# EAGLE design henryfc_v1.1 (EAGLE 9.6.2)
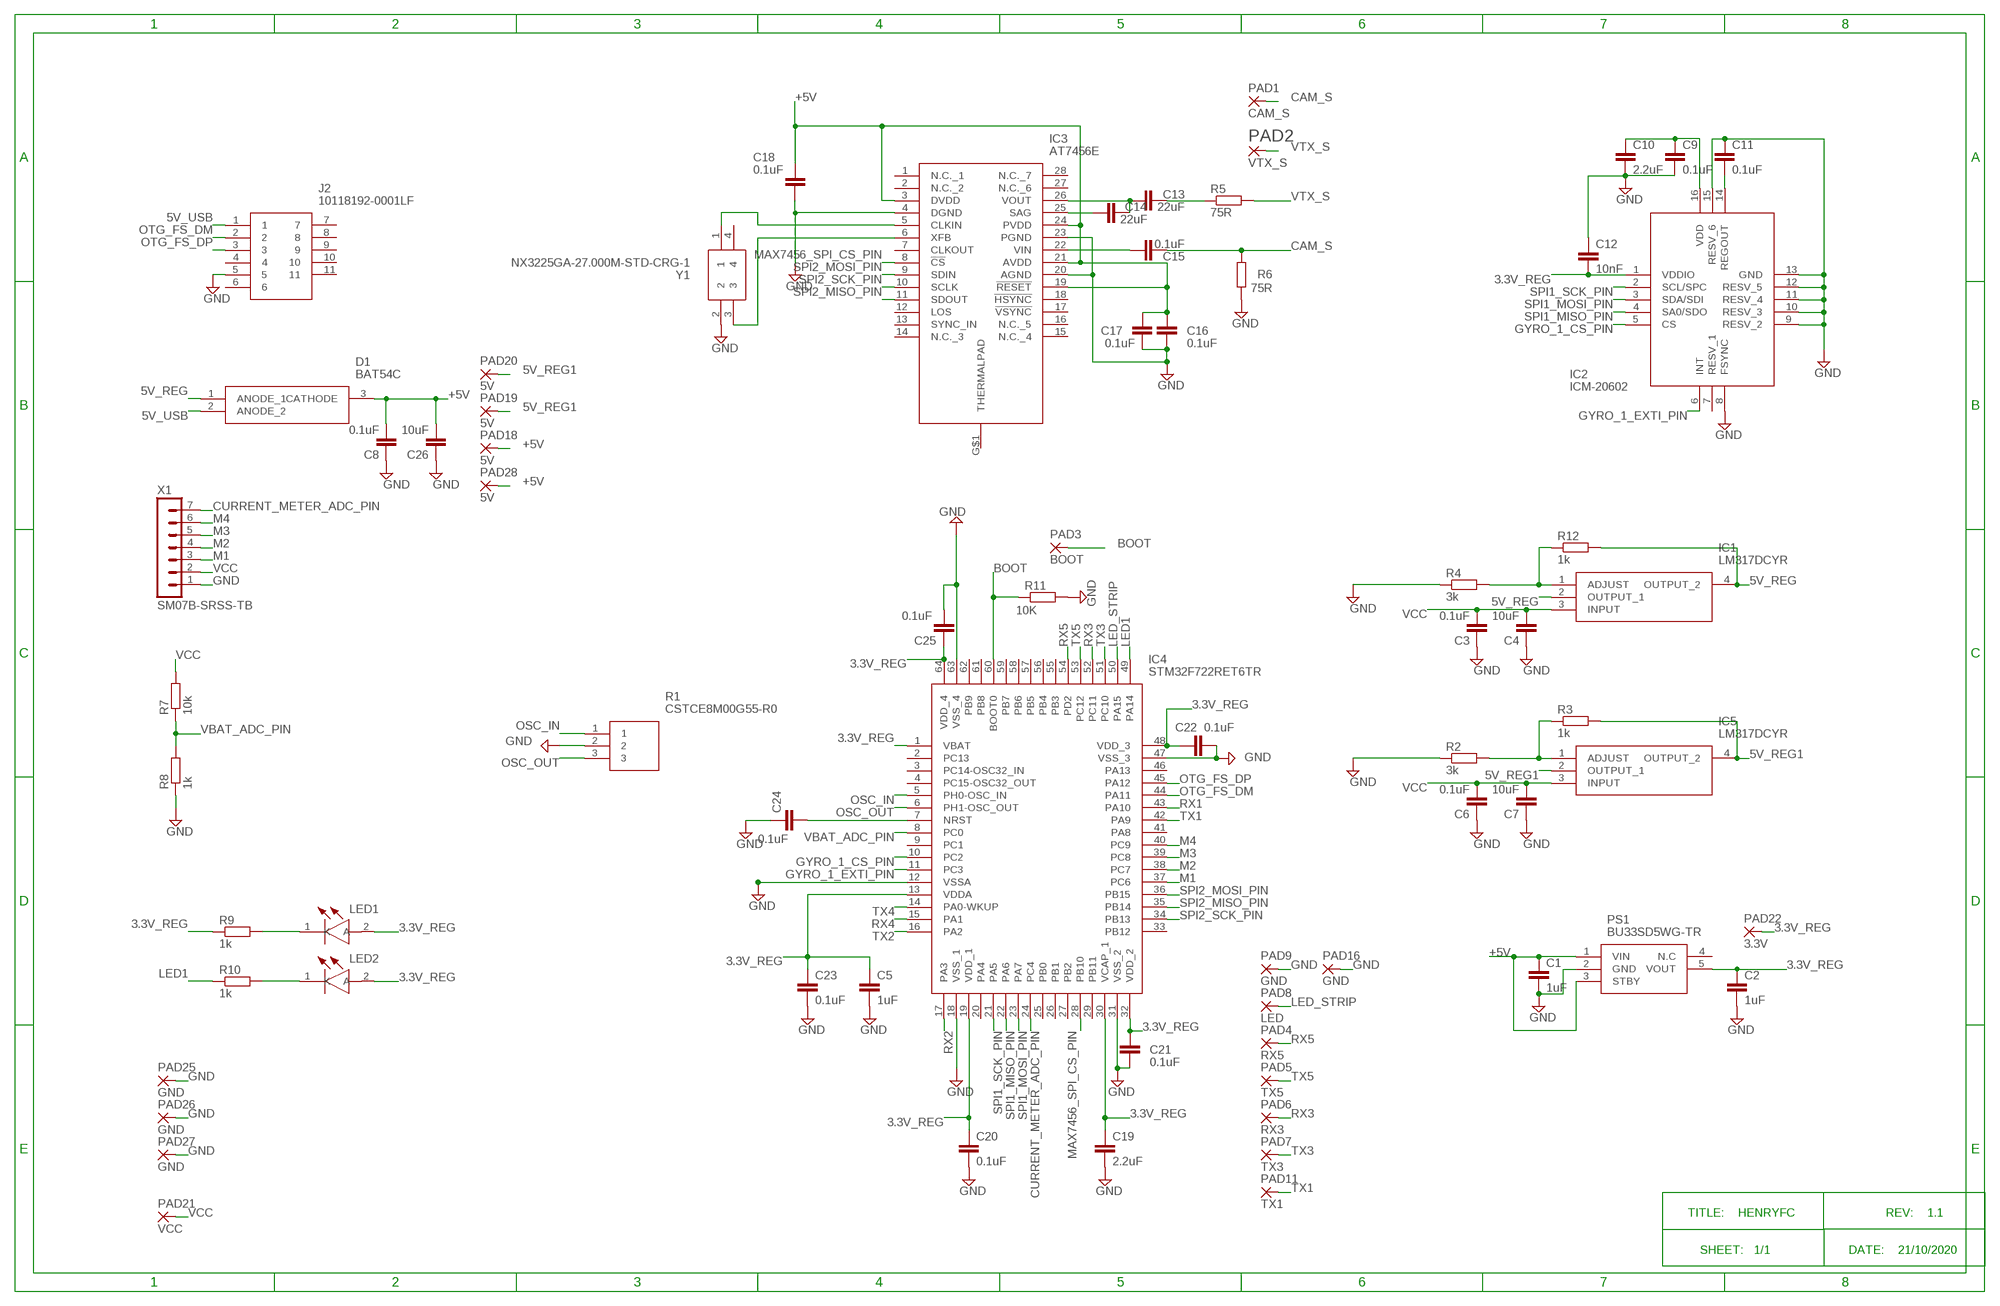
[diagram p0: schematic, sheet 1]

## Parts
C1  1uF  C-EUC0603  [C0603]
C2  1uF  C-EUC0603  [C0603]
C3  0.1uF  C-EUC0805  [C0805]
C4  10uF  C-EUC0805  [C0805]
C5  1uF  C-EUC0603  [C0603]
C6  0.1uF  C-EUC0805  [C0805]
C7  10uF  C-EUC0805  [C0805]
C8  0.1uF  C-EUC0805  [C0805]
C9  0.1uF  C-EUC0603  [C0603]
C10  2.2uF  C-EUC0603  [C0603]
C11  0.1uF  C-EUC0603  [C0603]
C12  10nF  C-EUC0603  [C0603]
C13  22uF  C-EUC0603  [C0603]
C14  22uF  C-EUC0603  [C0603]
C15  0.1uF  C-EUC0603  [C0603]
C16  0.1uF  C-EUC0603  [C0603]
C17  0.1uF  C-EUC0603  [C0603]
C18  0.1uF  C-EUC0603  [C0603]
C19  2.2uF  C-EUC0603  [C0603]
C20  0.1uF  C-EUC0603  [C0603]
C21  0.1uF  C-EUC0603  [C0603]
C22  0.1uF  C-EUC0603  [C0603]
C23  0.1uF  C-EUC0603  [C0603]
C24  0.1uF  C-EUC0603  [C0603]
C25  0.1uF  C-EUC0603  [C0603]
C26  10uF  C-EUC0805  [C0805]
D1  BAT54C  [SOT95P240X120-3N]
IC1  LM317DCYR  [SOT230P700X180-4N]
IC2  ICM-20602  [PULL-BACK-QFN-16]
IC3  AT7456E  [SOP65P640X120-29N]
IC4  STM32F722RET6TR  [QFP50P1200X1200X160-64N]
IC5  LM317DCYR  [SOT230P700X180-4N]
J2  10118192-0001LF  [101181920001LF]
LED1  KB_DELPS2.12-QHRI-24-Z555-10-S  [KBDELPS212QHRI24Z55510S]
LED2  KR_DELPS1.22-UHVI-26-H3Q4  [KRDELPS122UHVI26H3Q4]
PAD1  CAM_S  SMD2  [SMD1,27-2,54]
PAD2  VTX_S  SMD2  [SMD1,27-2,54]
PAD3  BOOT  SMD2  [SMD1,27-2,54]
PAD4  RX5  SMD2  [SMD1,27-2,54]
PAD5  TX5  SMD2  [SMD1,27-2,54]
PAD6  RX3  SMD2  [SMD1,27-2,54]
PAD7  TX3  SMD2  [SMD1,27-2,54]
PAD8  LED  SMD2  [SMD1,27-2,54]
PAD9  GND  SMD2  [SMD1,27-2,54]
PAD11  TX1  SMD2  [SMD1,27-2,54]
PAD16  GND  SMD2  [SMD1,27-2,54]
PAD18  5V  SMD2  [SMD1,27-2,54]
PAD19  5V  SMD2  [SMD1,27-2,54]
PAD20  5V  SMD2  [SMD1,27-2,54]
PAD21  VCC  SMD2  [SMD1,27-2,54]
PAD22  3.3V  SMD2  [SMD1,27-2,54]
PAD25  GND  SMD2  [SMD1,27-2,54]
PAD26  GND  SMD2  [SMD1,27-2,54]
PAD27  GND  SMD2  [SMD1,27-2,54]
PAD28  5V  SMD2  [SMD1,27-2,54]
PS1  BU33SD5WG-TR  [SOT95P280X125-5N]
R1  CSTCE8M00G55-R0  [CSTCE12M0G55-R0]
R2  3k  R-EU_R0603  [R0603]
R3  1k  R-EU_R0603  [R0603]
R4  3k  R-EU_R0603  [R0603]
R5  75R  R-EU_R0603  [R0603]
R6  75R  R-EU_R0603  [R0603]
R7  10k  R-EU_R0603  [R0603]
R8  1k  R-EU_R0603  [R0603]
R9  1k  R-EU_R0603  [R0603]
R10  1k  R-EU_R0603  [R0603]
R11  10K  R-EU_R0603  [R0603]
R12  1k  R-EU_R0603  [R0603]
X1  SM07B-SRSS-TB  [SM07B-SRSS-TB]
Y1  NX3225GA-27.000M-STD-CRG-1  [NX3225GA]

## Nets
3.3V_REG: C2.1 C5.1 C12.2 C19.1 C20.1 C21.1 C22.1 C23.1 C25.1 IC2.1(VDDIO) IC4.1(VBAT) IC4.13(VDDA) IC4.19(VDD_1) IC4.30(VCAP_1) IC4.32(VDD_2) IC4.48(VDD_3) IC4.64(VDD_4) LED1.2(A) LED2.2(A) PAD22.1(P) PS1.5(VOUT) R9.1
5V_REG: D1.1(ANODE_1) IC1.2(OUTPUT_1) IC1.4(OUTPUT_2) R12.2
5V_REG1: IC5.2(OUTPUT_1) IC5.4(OUTPUT_2) PAD19.1(P) PAD20.1(P) R3.2
5V_USB: D1.2(ANODE_2) J2.1
+5V: C1.1 C8.2 C16.1 C17.1 C18.2 C26.2 D1.3(CATHODE) IC3.3(DVDD) IC3.19(!RESET) IC3.21(AVDD) IC3.24(PVDD) PAD18.1(P) PAD28.1(P) PS1.1(VIN) PS1.3(STBY)
BOOT: IC4.60(BOOT0) PAD3.1(P) R11.1
CAM_S: C15.2 PAD1.1(P) R6.2
CURRENT_METER_ADC_PIN: IC4.24(PC4) X1.7
GND: C1.2 C2.2 C3.1 C4.1 C5.2 C6.1 C7.1 C8.1 C9.2 C10.2 C11.1 C12.1 C16.2 C17.2 C18.1 C19.2 C20.2 C21.2 C22.2 C23.2 C24.1 C25.2 C26.1 IC2.8(FSYNC) IC2.9(RESV_2) IC2.10(RESV_3) IC2.11(RESV_4) IC2.12(RESV_5) IC2.13(GND) IC2.15(RESV_6) IC3.4(DGND) IC3.20(AGND) IC3.23(PGND) IC4.12(VSSA) IC4.18(VSS_1) IC4.31(VSS_2) IC4.47(VSS_3) IC4.63(VSS_4) J2.5 PAD9.1(P) PAD16.1(P) PAD25.1(P) PAD26.1(P) PAD27.1(P) PS1.2(GND) R1.2 R2.1 R4.1 R6.1 R8.1 R11.2 X1.1 Y1.2
GYRO_1_CS_PIN: IC2.5(CS) IC4.10(PC2)
GYRO_1_EXTI_PIN: IC2.6(INT) IC4.11(PC3)
LED1: IC4.49(PA14) R10.1
LED_STRIP: IC4.50(PA15) PAD8.1(P)
M1: IC4.37(PC6) X1.3
M2: IC4.38(PC7) X1.4
M3: IC4.39(PC8) X1.5
M4: IC4.40(PC9) X1.6
MAX7456_SPI_CS_PIN: IC3.8(!CS) IC4.28(PB10)
N$1: IC5.1(ADJUST) R2.2 R3.1
N$2: IC1.1(ADJUST) R4.2 R12.1
N$5: C9.1 C10.1 IC2.16(VDD)
N$7: C11.2 IC2.14(REGOUT)
N$8: C14.1 IC3.25(SAG)
N$9: C13.1 C14.2 IC3.26(VOUT)
N$10: C13.2 R5.1
N$11: IC3.6(XFB) Y1.3
N$12: C15.1 IC3.22(VIN)
N$13: IC3.5(CLKIN) Y1.1
N$14: LED1.1(K) R9.2
N$15: LED2.1(K) R10.2
NRST: C24.2 IC4.7(NRST)
OSC_IN: IC4.5(PH0-OSC_IN) R1.1
OSC_OUT: IC4.6(PH1-OSC_OUT) R1.3
OTG_FS_DM: IC4.44(PA11) J2.2
OTG_FS_DP: IC4.45(PA12) J2.3
RX1: IC4.43(PA10)
RX2: IC4.17(PA3)
RX3: IC4.52(PC11) PAD6.1(P)
RX4: IC4.15(PA1)
RX5: IC4.54(PD2) PAD4.1(P)
SPI1_MISO_PIN: IC2.4(SA0/SDO) IC4.22(PA6)
SPI1_MOSI_PIN: IC2.3(SDA/SDI) IC4.23(PA7)
SPI1_SCK_PIN: IC2.2(SCL/SPC) IC4.21(PA5)
SPI2_MISO_PIN: IC3.11(SDOUT) IC4.35(PB14)
SPI2_MOSI_PIN: IC3.9(SDIN) IC4.36(PB15)
SPI2_SCK_PIN: IC3.10(SCLK) IC4.34(PB13)
TX1: IC4.42(PA9) PAD11.1(P)
TX2: IC4.16(PA2)
TX3: IC4.51(PC10) PAD7.1(P)
TX4: IC4.14(PA0-WKUP)
TX5: IC4.53(PC12) PAD5.1(P)
VBAT_ADC_PIN: IC4.8(PC0) R7.1 R8.2
VCC: C3.2 C4.2 C6.2 C7.2 IC1.3(INPUT) IC5.3(INPUT) PAD21.1(P) R7.2 X1.2
VTX_S: PAD2.1(P) R5.2
Unconnected: IC2.7(RESV_1) IC3.1(N.C._1) IC3.2(N.C._2) IC3.7(CLKOUT) IC3.12(LOS) IC3.13(SYNC_IN) IC3.14(N.C._3) IC3.15(N.C._4) IC3.16(N.C._5) IC3.17(!VSYNC) IC3.18(!HSYNC) IC3.27(N.C._6) IC3.28(N.C._7) IC3.G$1(THERMALPAD) IC4.2(PC13) IC4.3(PC14-OSC32_IN) IC4.4(PC15-OSC32_OUT) IC4.9(PC1) IC4.20(PA4) IC4.25(PB0) IC4.26(PB1) IC4.27(PB2) IC4.29(PB11) IC4.33(PB12) IC4.41(PA8) IC4.46(PA13) IC4.55(PB3) IC4.56(PB4) IC4.57(PB5) IC4.58(PB6) IC4.59(PB7) IC4.61(PB8) IC4.62(PB9) J2.4 J2.6 J2.7 J2.8 J2.9 J2.10 J2.11 PS1.4(N.C) Y1.4

## Notes on the sheet
- TITLE:    HENRYFC | REV:    1.1
- SHEET:   1/1 | DATE:    21/10/2020

## Library data of the parts
C1-C26 = rcl:C-EU: CAPACITOR, European symbol; SPICEPREFIX: C
D1 = SamacSys_Parts:BAT54C: 30 V Dual Common Cathode Schottky Diode Source: Datasheet <http://www.onsemi.com/pub/Collateral/BAT54-D.PDF>; ARROW_PART_NUMBER: BAT54C; ARROW_PRICE-STOCK: https://www.arrow.com/en/products/bat54c/on-semiconductor; DESCRIPTION: 30 V Dual Common Cathode Schottky Diode; HEIGHT: 1.2mm; MANUFACTURER_NAME: ON Semiconductor; MANUFACTURER_PART_NUMBER: BAT54C; MOUSER_PART_NUMBER: 512-BAT54C; MOUSER_PRICE-STOCK: https://www.mouser.co.uk/ProductDetail/ON-Semiconductor-Fairchild/BAT54C?qs=WjC1ij5gCHPafNqzK0iwGA%3D%3D
IC1 IC5 = SamacSys_Parts:LM317DCYR: LM317DCYR, Linear Voltage Regulator, 1.5A Adjustable 1.25 37 V, 4-Pin SOT-223 Source: Datasheet <http://www.ti.com/lit/ds/symlink/lm317.pdf>; ARROW_PART_NUMBER: LM317DCYR; ARROW_PRICE-STOCK: https://www.arrow.com/en/products/lm317dcyr/texas-instruments; DESCRIPTION: LM317DCYR, Linear Voltage Regulator, 1.5A Adjustable 1.25 37 V, 4-Pin SOT-223; HEIGHT: 1.8mm; MANUFACTURER_NAME: Texas Instruments; MANUFACTURER_PART_NUMBER: LM317DCYR; MOUSER_PART_NUMBER: 595-LM317DCYR; MOUSER_PRICE-STOCK: https://www.mouser.co.uk/ProductDetail/Texas-Instruments/LM317DCYR?qs=YhsVCygOPE0H9jB5Yaa05Q%3D%3D
IC2 = SamacSys_Parts:ICM-20602: High Performance 6-Axis MEMS MotionTracking Device, QFN-16 Source: Datasheet <https://www.invensense.com/wp-content/uploads/2015/12/ICM-20602-Product-Brief-v1.0.pdf>; ARROW_PART_NUMBER: ICM-20602; ARROW_PRICE-STOCK: https://www.arrow.com/en/products/icm-20602/invensense; DESCRIPTION: High Performance 6-Axis MEMS MotionTracking Device, QFN-16; HEIGHT: mm; MANUFACTURER_NAME: InvenSense Inc.; MANUFACTURER_PART_NUMBER: ICM-20602; MOUSER_PART_NUMBER: 410-ICM-20602; MOUSER_PRICE-STOCK: https://www.mouser.co.uk/ProductDetail/TDK-InvenSense/ICM-20602?qs=u4fy%2FsgLU9NtDChFbqTxBA%3D%3D
IC3 = SamacSys_Parts:AT7456E: Video Character Overlay Chip (OSD) Source: Datasheet <https://datasheet.lcsc.com/szlcsc/ZHONGKEWEI-AT7456E_C82351.pdf>; ARROW_PART_NUMBER: AT7456E; DESCRIPTION: Video Character Overlay Chip (OSD); HEIGHT: 1.2mm; MANUFACTURER_NAME: ICOF; MANUFACTURER_PART_NUMBER: AT7456E
IC4 = SamacSys_Parts:STM32F722RET6TR: ARM Microcontrollers - MCU Source: Datasheet <https://componentsearchengine.com/Datasheets/1/STM32F722RET6TR.pdf>; ARROW_PART_NUMBER: STM32F722RET6TR; DESCRIPTION: ARM Microcontrollers - MCU; HEIGHT: 1.6mm; MANUFACTURER_NAME: STMicroelectronics; MANUFACTURER_PART_NUMBER: STM32F722RET6TR; MOUSER_PART_NUMBER: 511-STM32F722RET6TR; MOUSER_PRICE-STOCK: https://www.mouser.co.uk/ProductDetail/STMicroelectronics/STM32F722RET6TR?qs=%252B6g0mu59x7LDsd7i9LBalQ%3D%3D
J2 = SamacSys_Parts:10118192-0001LF: USB Connectors 5P MICRO USB TYPE B RECEPTACLE Source: Datasheet <https://www.mouser.tw/datasheet/2/18/10118192-1361887.pdf>; ARROW_PART_NUMBER: 10118192-0001LF; ARROW_PRICE-STOCK: https://www.arrow.com/en/products/10118192-0001lf/amphenol-fci; DESCRIPTION: USB Connectors 5P MICRO USB TYPE B RECEPTACLE; HEIGHT: 2.8mm; MANUFACTURER_NAME: Amphenol; MANUFACTURER_PART_NUMBER: 10118192-0001LF; MOUSER_PART_NUMBER: 649-10118192-0001LF; MOUSER_PRICE-STOCK: https://www.mouser.co.uk/ProductDetail/Amphenol-FCI/10118192-0001LF?qs=Ywefl8B65e5bHFoQtIudZg%3D%3D
LED1 = SamacSys_Parts:KB_DELPS2.12-QHRI-24-Z555-10-S: Standard LEDs - SMD Blue TOPLED E 1608 Source: Datasheet <https://www.mouser.in/ProductDetail/OSRAM-Opto-Semiconductors/KB-DELPS212-QHRI-24-Z555-10-S?qs=/ha2pyFaduguGXnxUQPQvOwqvA0l1GbBGsJPdL2BNxwU00XGTd8yf8CXZb0fb41Mz9FjufZkGgQ=>; ARROW_PART_NUMBER: KB DELPS2.12-QHRI-24-Z555-10-S; DESCRIPTION: Standard LEDs - SMD Blue TOPLED E 1608; HEIGHT: mm; MANUFACTURER_NAME: OSRAM; MANUFACTURER_PART_NUMBER: KB DELPS2.12-QHRI-24-Z555-10-S; MOUSER_PART_NUMBER: 720-KBDELPS212A6350; MOUSER_PRICE-STOCK: https://www.mouser.co.uk/ProductDetail/OSRAM-Opto-Semiconductors/KB-DELPS212-QHRI-24-Z555-10-S?qs=OTrKUuiFdkb2rezknsx9mQ%3D%3D
LED2 = SamacSys_Parts:KR_DELPS1.22-UHVI-26-H3Q4: Standard LEDs - SMD Red TOPLED E 1608 Source: Datasheet <https://www.mouser.co.uk/ProductDetail/OSRAM-Opto-Semiconductors/KR-DELPS122-UHVI-26-H3Q4?qs=sGAEpiMZZMseGfSY3csMkXiJOH5X%2BfXw4kv80xILcLqjWCSyCkalLg==>; ARROW_PART_NUMBER: KR DELPS1.22-UHVI-26-H3Q4; DESCRIPTION: Standard LEDs - SMD Red TOPLED E 1608; HEIGHT: mm; MANUFACTURER_NAME: OSRAM; MANUFACTURER_PART_NUMBER: KR DELPS1.22-UHVI-26-H3Q4; MOUSER_PART_NUMBER: 720-KRDELPS122A5163; MOUSER_PRICE-STOCK: https://www.mouser.co.uk/ProductDetail/OSRAM-Opto-Semiconductors/KR-DELPS122-UHVI-26-H3Q4?qs=XeJtXLiO41Rxc1kIEv94zQ%3D%3D
PAD1-PAD9 PAD11 PAD16 PAD18-PAD22 PAD25-PAD28 = wirepad:SMD2: SMD PAD
PS1 = SamacSys_Parts:BU33SD5WG-TR: LDO regulator,3.3V,0.5A,standby,SSOP5 ROHM BU33SD5WG-TR, LDO Voltage Regulator, 0.5A, 3.3 V +/-2%, 1.7 6 Vin, 5-Pin SSOP Source: Datasheet <https://componentsearchengine.com/Datasheets/1/BU33SD5WG-TR.pdf>; ARROW_PART_NUMBER: BU33SD5WG-TR; DESCRIPTION: LDO regulator,3.3V,0.5A,standby,SSOP5 ROHM BU33SD5WG-TR, LDO Voltage Regulator, 0.5A, 3.3 V +/-2%, 1.7 6 Vin, 5-Pin SSOP; HEIGHT: 1.25mm; MANUFACTURER_NAME: ROHM Semiconductor; MANUFACTURER_PART_NUMBER: BU33SD5WG-TR; MOUSER_PART_NUMBER: 755-BU33SD5WG-TR; MOUSER_PRICE-STOCK: https://www.mouser.co.uk/ProductDetail/ROHM-Semiconductor/BU33SD5WG-TR?qs=%2FKR40Cd6GUrQDzRkUEt69Q%3D%3D
R1 = SamacSys_Parts:CSTCE8M00G55-R0: SMT ceramic resonator 8.0MHz CSTCE8M00G55-R0, Ceramic Resonator, 8MHz Fundamental 33pF, 3-Pin Cap Chip, 3.2 x 1.3 x 0.7mm Source: Datasheet <http://www.murata.com/en-eu/api/pdfdownloadapi?cate=&partno=CSTCE8M00G55-R0>; ARROW_PART_NUMBER: CSTCE8M00G55-R0; ARROW_PRICE-STOCK: https://www.arrow.com/en/products/cstce8m00g55-r0/murata-manufacturing; DESCRIPTION: SMT ceramic resonator 8.0MHz CSTCE8M00G55-R0, Ceramic Resonator, 8MHz Fundamental 33pF, 3-Pin Cap Chip, 3.2 x 1.3 x 0.7mm; HEIGHT: mm; MANUFACTURER_NAME: Murata Electronics; MANUFACTURER_PART_NUMBER: CSTCE8M00G55-R0; MOUSER_PART_NUMBER: 81-CSTCE8M00G55-R0; MOUSER_PRICE-STOCK: https://www.mouser.co.uk/ProductDetail/Murata-Electronics/CSTCE8M00G55-R0?qs=eoDEeL6nyORcaHhGM345mw%3D%3D
R2-R12 = rcl:R-EU_: RESISTOR, European symbol; SPICEPREFIX: R
X1 = con-jst:SM07B-SRSS: JST SH series header 1.00mm pitch disconnectable crimp style connectors, horizontal (side entry type), 7 pins
Y1 = SamacSys_Parts:NX3225GA-27.000M-STD-CRG-1: Crystals CRYSTAL 27MHz 8PF SMD Source: Datasheet <https://www.ndk.com/images/products/catalog/c_NX3225GA-STD-CRG-2_e.pdf>; ARROW_PART_NUMBER: NX3225GA-27.000M-STD-CRG-1; DESCRIPTION: Crystals CRYSTAL 27MHz 8PF SMD; HEIGHT: mm; MANUFACTURER_NAME: NDK; MANUFACTURER_PART_NUMBER: NX3225GA-27.000M-STD-CRG-1; MOUSER_PART_NUMBER: 344-NX3225GA27MSTRG1; MOUSER_PRICE-STOCK: https://www.mouser.com/Search/Refine.aspx?Keyword=344-NX3225GA27MSTRG1

## Board
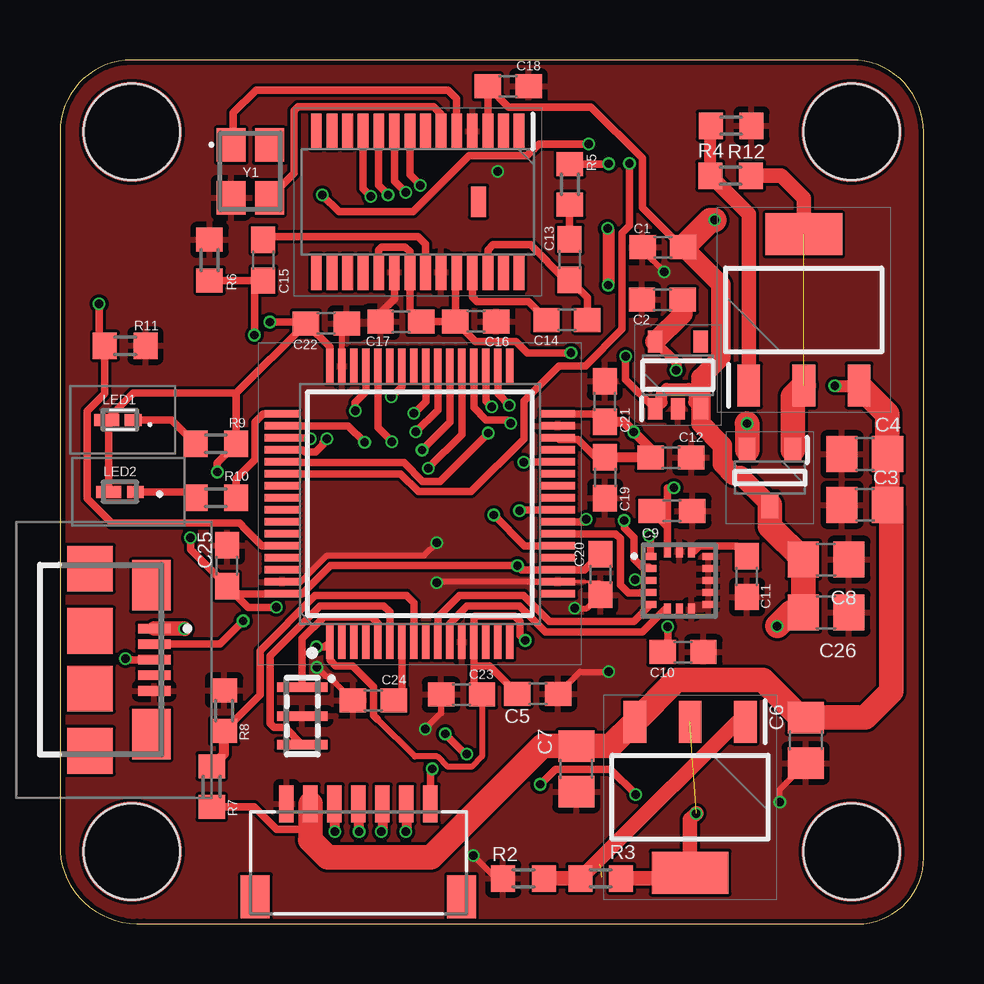
[diagram p1: board, top side]
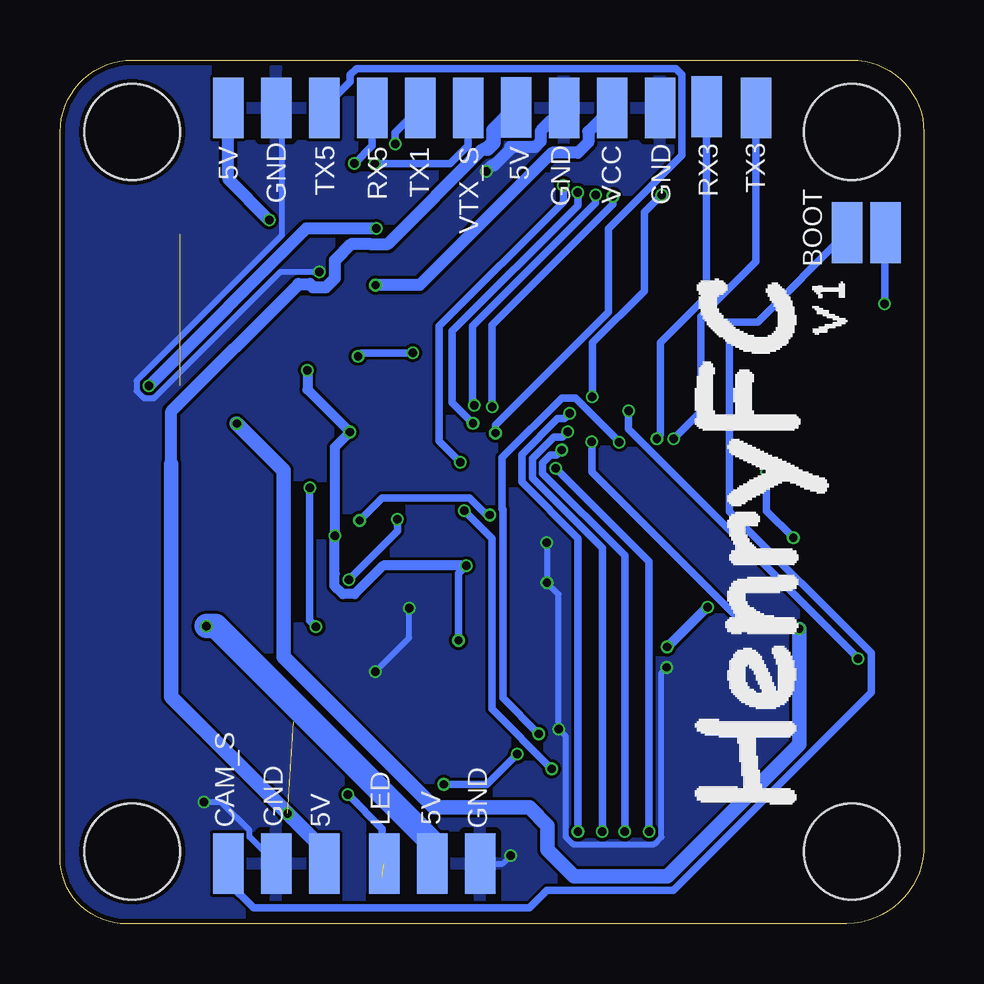
[diagram p2: board, bottom side, seen from below]

Size 36.01 x 36.01 mm. Coordinates in mm from the lower left corner, seen from the top.
Outline: 33,36.01 3,36.01 arc90 0,33.01 0,3.01 arc90 3.5,0.01 33.5,0.01 arc90 36,3.01 36,33.01 arc90 33,36.01
Copper layers (1*16): Top 0.035559375mm / dielectric 1.6mm / Bottom 0.035559375mm
Design rules "jlcpcb2layer": minimum track width 5mil, minimum drill 12mil, track to track 5mil, track to pad 5mil, pad to pad 5mil, via to via 5mil, smd to smd 5mil, copper to edge 8mil, drill to drill 6mil, minimum pad ring 5mil, minimum via ring 3mil, stop-mask expansion 2.5mil, vias tented up to drill 0mil, thermal gap 10mil
Holes 4 mm at 3,33.01 33,33.01 33,3.01 3,3.01

### Footprints (pad centres in the part's own frame; a part is rotated, then mirrored left to right if it is on the bottom)
C0603 = smd 1.1 x 1: 1 -0.85,0; 2 0.85,0
C0805 = smd 1.3 x 1.5: 1 -0.95,0; 2 0.95,0
SOT95P240X120-3N = smd 1.05 x 0.7: 1 -1.15,0.95; 2 -1.15,-0.95; 3 1.15,0
SOT230P700X180-4N = smd 1.75 x 0.95: 1 -3.15,2.3; 2 -3.15,0; 3 -3.15,-2.3 | smd 1.75 x 3.2: 4 3.15,0
PULL-BACK-QFN-16 = smd 0.5 x 0.3: 1 -1.2,1; 2 -1.2,0.5; 3 -1.2,0; 4 -1.2,-0.5; 5 -1.2,-1; 9 1.2,-1; 10 1.2,-0.5; 11 1.2,0; 12 1.2,0.5; 13 1.2,1 | smd 0.3 x 0.5: 6 -0.5,-1.2; 7 0,-1.2; 8 0.5,-1.2; 14 0.5,1.2; 15 0,1.2; 16 -0.5,1.2
SOP65P640X120-29N = smd 1.475 x 0.45: 1 -2.938,4.225; 2 -2.938,3.575; 3 -2.938,2.925; 4 -2.938,2.275; 5 -2.938,1.625; 6 -2.938,0.975; 7 -2.938,0.325; 8 -2.938,-0.325; 9 -2.938,-0.975; 10 -2.938,-1.625; 11 -2.938,-2.275; 12 -2.938,-2.925; 13 -2.938,-3.575; 14 -2.938,-4.225; 15 2.938,-4.225; 16 2.938,-3.575; 17 2.938,-2.925; 18 2.938,-2.275; 19 2.938,-1.625; 20 2.938,-0.975; 21 2.938,-0.325; 22 2.938,0.325; 23 2.938,0.975; 24 2.938,1.625; 25 2.938,2.275; 26 2.938,2.925; 27 2.938,3.575; 28 2.938,4.225 | smd 1.27 x 0.635: G$1 0,2.54
QFP50P1200X1200X160-64N = smd 1.45 x 0.3: 1 -5.75,3.75; 2 -5.75,3.25; 3 -5.75,2.75; 4 -5.75,2.25; 5 -5.75,1.75; 6 -5.75,1.25; 7 -5.75,0.75; 8 -5.75,0.25; 9 -5.75,-0.25; 10 -5.75,-0.75; 11 -5.75,-1.25; 12 -5.75,-1.75; 13 -5.75,-2.25; 14 -5.75,-2.75; 15 -5.75,-3.25; 16 -5.75,-3.75; 33 5.75,-3.75; 34 5.75,-3.25; 35 5.75,-2.75; 36 5.75,-2.25; 37 5.75,-1.75; 38 5.75,-1.25; 39 5.75,-0.75; 40 5.75,-0.25; 41 5.75,0.25; 42 5.75,0.75; 43 5.75,1.25; 44 5.75,1.75; 45 5.75,2.25; 46 5.75,2.75; 47 5.75,3.25; 48 5.75,3.75 | smd 0.3 x 1.45: 17 -3.75,-5.75; 18 -3.25,-5.75; 19 -2.75,-5.75; 20 -2.25,-5.75; 21 -1.75,-5.75; 22 -1.25,-5.75; 23 -0.75,-5.75; 24 -0.25,-5.75; 25 0.25,-5.75; 26 0.75,-5.75; 27 1.25,-5.75; 28 1.75,-5.75; 29 2.25,-5.75; 30 2.75,-5.75; 31 3.25,-5.75; 32 3.75,-5.75; 49 3.75,5.75; 50 3.25,5.75; 51 2.75,5.75; 52 2.25,5.75; 53 1.75,5.75; 54 1.25,5.75; 55 0.75,5.75; 56 0.25,5.75; 57 -0.25,5.75; 58 -0.75,5.75; 59 -1.25,5.75; 60 -1.75,5.75; 61 -2.25,5.75; 62 -2.75,5.75; 63 -3.25,5.75; 64 -3.75,5.75
101181920001LF = smd 0.4 x 1.35: 1 -1.3,1.682; 2 -0.65,1.682; 3 0,1.682; 4 0.65,1.682; 5 1.3,1.682 | smd 2.1 x 1.6: 6 -3.1,1.557; 7 3.1,1.557 | smd 1.9 x 1.9: 8 -1.2,-0.993; 9 1.2,-0.993; 10 -3.8,-0.993; 11 3.8,-0.993
KBDELPS212QHRI24Z55510S = smd 0.7 x 0.5: 1 -0.558,0 | smd 1.05 x 0.5: 2 0.558,0
KRDELPS122UHVI26H3Q4 = smd 0.7 x 0.5: 1 -0.645,0 | smd 1.05 x 0.5: 2 0.47,0
SMD1,27-2,54 = smd 1.27 x 2.54: 1 0,0
SOT95P280X125-5N = smd 0.9 x 0.6: 1 -1.4,0.95; 2 -1.4,0; 3 -1.4,-0.95; 4 1.4,-0.95; 5 1.4,0.95
CSTCE12M0G55-R0 = smd 0.4 x 2.1: 1 -1.2,0; 2 0,0; 3 1.2,0
R0603 = smd 1 x 1.1: 1 -0.85,0; 2 0.85,0
SM07B-SRSS-TB = smd 0.6 x 1.55: 1 3,0; 2 2,0; 3 1,0; 4 0,0; 5 -1,0; 6 -2,0; 7 -3,0 | smd 1.2 x 1.8: M1 4.3,3.875; M2 -4.3,3.875
NX3225GA = smd 1.4 x 1.2: 1 -1.1,-0.8; 2 1.1,-0.8; 3 1.1,0.8; 4 -1.1,0.8

### Placement (x,y rotation side)
C1  25.13,28.2 180 top
C2  25.11,26.02 180 top
C3  33.55,17.46 0 top
C4  33.55,19.58 0 top
C5  19.92,9.59 0 top
C6  31.09,7.64 90 top
C7  21.53,6.46 90 top
C8  31.94,15.18 180 top
C9  25.51,17.21 0 top
C10  25.97,11.32 0 top
C11  28.64,14.48 90 top
C12  25.47,19.43 180 top
C13  21.25,27.69 90 top
C14  21.13,25.17 0 top
C15  8.47,27.66 270 top
C16  17.34,25.1 0 top
C17  14.22,25.1 180 top
C18  18.69,34.91 180 top
C19  22.72,18.59 270 top
C20  22.52,14.56 270 top
C21  22.72,21.77 90 top
C22  11.1,25.03 0 top
C23  16.74,9.56 180 top
C24  13.06,9.3 0 top
C25  6.97,14.92 90 top
C26  31.94,12.98 180 top
D1  29.6,18.6 270 top
IC1  31.01,25.59 90 top
IC2  25.82,14.31 0 top
IC3  14.91,30.09 270 top
IC4  15,17.51 90 top
IC5  26.27,5.27 270 top
J2  2.25,11.01 270 top
LED1  2.5,21.01 180 top
LED2  2.5,18.01 180 top
PAD1  29,2.51 0 bottom
PAD2  19,34.01 180 bottom
PAD3  1.6,28.81 180 bottom
PAD4  23,34.01 180 bottom
PAD5  25,34.01 180 bottom
PAD6  9.06,34.07 180 bottom
PAD7  7,34.01 180 bottom
PAD8  22.5,2.51 180 bottom
PAD9  27,34.01 180 bottom
PAD11  21,34.01 180 bottom
PAD16  27,2.51 0 bottom
PAD18  29,34.01 0 bottom
PAD19  16.99,34.03 180 bottom
PAD20  25,2.51 180 bottom
PAD21  13,34.01 0 bottom
PAD22  3.2,28.81 180 bottom
PAD25  11,34.01 0 bottom
PAD26  15,34.01 0 bottom
PAD27  18.5,2.51 180 bottom
PAD28  20.5,2.51 0 bottom
PS1  25.76,22.87 90 top
R1  10.1,8.66 270 top
R2  19.33,1.89 0 top
R3  22.54,1.89 0 top
R4  27.98,33.27 180 top
R5  21.25,30.82 90 top
R6  6.23,27.66 270 top
R7  6.33,5.72 270 top
R8  6.84,8.88 270 top
R9  6.5,20.01 180 top
R10  6.5,17.76 180 top
R11  2.72,24.09 0 top
R12  27.96,31.18 0 top
X1  12.44,5 180 top
Y1  7.93,31.37 270 top

### Tracks (layer width: path | path; a pad name or v marks a point on that pad's centre or on a via)
3.3V_REG  (via drill 0.35)
  Top 0.254: C23.1 17.59,6.97 17.17,6.55 16.16,6.55 15.73,6.98 14.79,6.98 13.24,8.52
  Top 0.305: IC4.32 22.38,21.26 C21.1 | IC4.30 20.82,20.19 21.59,20.19 22.34,19.44 22.65,19.44 C19.1 | C20.1 21.87,14.76 IC4.19 19.25,14.76 v19.07,14.93 19.06,14.95 11.29,14.95 10.1,13.76 IC4.64 7.28,13.76 C25.1 | C23.1 17.25,9.9 IC4.13 | C5.1 17.91,10.76 17.26,10.76 17.25,10.77 IC4.13 | C22.1 11.25,24.03 IC4.48 | 13.24,8.52 13.08,8.69 13.08,9.88 12.2,10.76 11.48,10.76 11.25,10.99 IC4.1 11.03,11.54 v10.69,11.54 | LED2.2 2.03,20.92 LED1.2 3.06,22.13 7.35,22.13 | C22.1 7.35,22.13 | 7.35,22.13 R9.1 6.56,19.22 v6.56,18.83 | v8.74,25.08 10.2,25.08 C22.1 | IC4.13 17.25,12.76 17.31,12.83 18.95,12.83 19.18,12.6 19.18,12.03 v19.4,11.81 | v9.01,13.2 7.85,13.2 C25.1 | C25.1 5.44,15.6 v5.44,16.1 | IC2.1 24.62,16.11 v24.56,16.17
  Top 0.406: 22.65,19.44 22.67,19.43 C12.2 24.62,19.81 v23.92,20.5 23.5,20.92 C21.1 | PS1.5 25.69,23.39 v25.69,23.08
  Top 0.813: PS1.5 25.96,25.42 C2.1
  Bottom 0.305: PAD22.1 6.93,25.08 v8.74,25.08 | v19.07,14.93 19.4,14.61 v19.4,11.81 | v5.44,16.1 6.56,17.21 v6.56,18.83
  Bottom 0.406: v19.07,14.93 22.54,14.93 23.73,13.74 24.22,13.74 24.57,14.09 24.57,14.58 24.56,14.59 v24.56,16.17 24.56,19.86 v23.92,20.5 25.69,22.27 v25.69,23.08 | v10.69,11.54 9.04,13.2 v9.01,13.2
5V_REG  (1 unrouted)
  Top 0.61: R12.2 | R12.2 30.08,31.18 31.01,30.25 IC1.4
  Top 1.016: IC1.2 30.55,21.98 D1.1
5V_REG1  (via drill 0.35)  (1 unrouted)
  Top 0.61: R3.2 26.03,1.89 IC5.4 26.27,4.34 v26.52,4.6
  Bottom 0.508: 31.38,19.16 31.38,21.36 26.07,26.67 25.59,26.67 25.46,26.53 24.93,26.53 24.55,26.91 24.55,27.44 24.55,27.45 24.55,27.65 23.85,28.35 23.1,28.35 23.09,28.34 22.34,28.34 18.38,32.31 18.19,32.31
  Bottom 0.61: PAD20.1 25,3.08 v26.52,4.6 31.38,9.45 31.38,19.16 | PAD19.1 17.93,33.09 17.93,32.56 18.19,32.31 18.22,32.31
5V_USB  (via drill 0.35)
  Top 0.61: J2.1 v5.18,12.31 v5.19,12.3
  Top 1.016: D1.2 v28.65,20.84 v28.64,20.85
  Bottom 0.61: v28.64,20.85 26.69,18.9 26.69,11.12 20.43,4.85 16.45,4.85 15.69,4.09 15.69,3.07 14.59,1.97 10.69,1.97 5.19,7.48 v5.19,12.3
+5V  (via drill 0.35)
  Top 0.305: IC3.3 C18.2 18.7,34.05 22.14,34.05 24.28,31.91 24.28,29.86 25.93,28.2 C1.1 | C16.1 16.49,27.1 IC3.24 | C16.1 C17.1 14.59,25.58 IC3.21 14.59,28.01 14.39,28.21 13.41,28.21 13.29,28.08 IC3.19 | PS1.1 23.58,22.7 v23.58,23.66 | C16.1 17.33,24.26 19.02,24.26 19.48,23.8 v21.3,23.8
  Top 0.508: PS1.1 25.08,21.74 25.08,22.08 25.3,22.3 26.22,22.3 26.44,22.08 26.44,21.74 PS1.3
  Top 0.813: D1.3 28.36,18.69 28.08,18.69 27.61,19.16 27.61,19.95 26.71,20.84 PS1.3 26.71,22.77 27.54,23.6 27.54,26.64 C1.1
  Top 1.016: D1.3 29.6,16.57 C8.2 C26.2 30.47,12.98 v29.9,12.41 | C1.1 27.12,29.34 v27.29,29.34
  Bottom 0.305: v21.3,23.8 23.44,23.8 v23.58,23.66
  Bottom 0.508: v27.29,29.34 29,31.05 PAD18.1
  Bottom 1.016: v29.9,12.41 29.52,12.41 20.5,3.39 PAD28.1
BOOT  (via drill 0.35)
  Top 0.305: v1.63,25.85 1.63,24.33 R11.1 1.87,22.11 1.14,21.38 1.14,17.73 2.17,16.7 7.48,16.7 7.74,16.44 7.74,16.43 8.42,15.76 IC4.60
  Bottom 0.305: v1.63,25.85 1.63,28.78 PAD3.1
CAM_S  (via drill 0.35)
  Top 0.305: R6.2 C15.2 | C15.2 | C15.2 8.1,26.44 v8.1,24.54
  Bottom 0.305: v8.1,24.54 8.1,17.2 2.19,11.28 2.19,9.65 10.45,1.39 15.71,1.39 16.44,0.66 27.94,0.66 29,1.72 PAD1.1
CURRENT_METER_ADC_PIN  (via drill 0.35)
  Top 0.305: X1.7 15.44,6.38 v15.52,6.46 | v19.16,17.21 19.2,17.26 IC4.24
  Bottom 0.305: v15.52,6.46 18.01,8.95 18.01,16.06 v19.16,17.21
GND  (via drill 0.35)
  Top 0.127: C20.2 22.52,14.26 IC4.18
  Top 0.254: IC4.18 15.71,14.26 v15.71,14.22 | C23.2 15.89,8.79 v15.23,8.12 | IC4.63 10.03,14.26 11.12,15.35 15.18,15.35 v15.72,15.88 | v10.71,10.69 11.09,10.31 11.25,10.31 11.4,10.17 11.4,10.11 C24.1 | C5.2 21.68,10.5 v22.87,10.5 | v21.45,13.15 21.96,13.15 C20.2 | v30.01,5.07 30.01,5.61 C6.1 | v17.23,2.84 18.18,1.89 R2.1 | v25.19,27.18 24.28,28.09 C1.2 | IC4.47 11.75,24.83 C22.2
  Top 0.305: C17.2 13.37,25.47 13.94,26.05 IC3.20
  Bottom 0.254: v15.72,15.88 v15.72,14.23 v15.71,14.22 15.23,13.74 v15.23,8.12 14.93,7.82 14.93,3.62 14.63,3.32 11.24,3.32 10.94,3.62 10.94,10.46 v10.71,10.69 | v22.87,10.5 21.45,11.92 v21.45,13.15 | PAD16.1 28.11,3.62 28.11,3.88 29.29,5.07 v30.01,5.07 | PAD27.1 17.56,2.51 v17.23,2.84 | v25.19,27.18 26.82,27.18 32.09,21.91 32.52,21.91 32.82,22.21 32.82,22.64 26.77,28.69 26.77,33.78 PAD9.1
  Bottom 0.508: PAD26.1 15.98,33.03 15.98,32.6 16.2,32.38 17.25,32.38 17.25,32.28 17.9,31.62 17.99,31.62 v18.25,31.37
  pour Top: -3,39.51 40,39.51 40,-1.99 -3,-1.99
  pour Bottom: -2,38.01 38.5,38.01 38.5,-2.49 -2,-2.49
GYRO_1_CS_PIN
  Top 0.305: IC4.10 15.75,12.79 16.65,13.69 19.33,13.69 20.41,12.61 21.77,12.61 | IC2.5 23.92,12.61 21.77,12.61 | 21.77,12.61
GYRO_1_EXTI_PIN
  Top 0.305: IC2.6 25.22,13.11 24.27,12.17 20.24,12.17 19.15,13.26 16.98,13.26 16.25,12.53 IC4.11
LED1
  Top 0.305: R10.1 7.35,18.56 8.13,19.34 8.13,20.91 8.47,21.26 IC4.49
LED_STRIP  (via drill 0.35)  (1 unrouted)
  Top 0.305: IC4.50 12.02,20.76 v12.7,20.08 | v16.06,7.92 16.91,7.06 v16.95,7.06 | v20.01,5.81 20.03,5.81 20.66,6.44 22.95,6.44 v24.01,5.38
  Bottom 0.305: v12.7,20.08 14.53,21.91 15.09,21.91 17.58,19.43 17.58,17.3 17.55,17.27 17.55,9.41 v16.06,7.92 | v16.95,7.06 18.21,5.81 v20.01,5.81 | v24.01,5.38 22.58,3.96 22.58,1.93
M1  (via drill 0.35)
  Top 0.305: IC4.37 16.75,20.39 v15.35,18.99
  Top 0.406: X1.3 11.45,4.99 v11.45,3.84
  Bottom 0.305: v11.45,3.84 11.45,15.09 v15.35,18.99
M2  (via drill 0.35)
  Top 0.305: IC4.38 16.25,20.91 v15.09,19.75
  Top 0.406: X1.4 12.44,3.86 v12.47,3.84
  Bottom 0.305: v12.47,3.84 12.47,15.34 15.89,18.76 15.89,19.21 15.57,19.53 15.31,19.53 v15.09,19.75
M3  (via drill 0.35)
  Top 0.305: IC4.39 15.75,21.42 v14.84,20.51
  Top 0.406: X1.5 13.44,3.88 v13.4,3.84
  Bottom 0.305: v13.4,3.84 13.4,15.66 16.32,18.59 16.32,19.39 15.42,20.29 15.06,20.29 v14.84,20.51
M4  (via drill 0.35)
  Top 0.305: IC4.40 15.25,21.77 v14.75,21.27
  Top 0.406: X1.6 14.44,3.86 v14.42,3.84
  Bottom 0.305: v14.42,3.84 14.42,16.07 16.75,18.41 16.75,19.57 15.27,21.05 14.97,21.05 v14.75,21.27
MAX7456_SPI_CS_PIN  (via drill 0.35)
  Top 0.305: IC3.8 14.59,31.22 v15.02,30.78 | v19.33,19.24 20.73,19.24 IC4.28
  Bottom 0.305: v19.33,19.24 20.21,20.12 20.21,24.91 15.02,30.09 v15.02,30.78
N$1
  Top 0.61: R3.1 | R3.1 R2.2 | IC5.1 28.23,8.42 22.82,3.01 | 22.82,3.01 | 22.82,3.01 R3.1
N$2
  Top 0.508: R12.1 27.11,33.25 R4.2
  Top 0.61: R12.1 28.71,29.58 IC1.1
N$5  (via drill 0.35)
  Top 0.305: C9.1 25.32,16.55 | 25.32,16.55 25.32,16.31 IC2.16 | 25.32,16.55 25.32,18.18 v25.6,18.18 | v25.34,12.39 25.34,11.54 C10.1
  Bottom 0.305: v25.6,18.18 25.6,12.64 v25.34,12.39
N$7
  Top 0.305: IC2.14 26.43,15.51 26.66,15.74 28.23,15.74 C11.2
N$8
  Top 0.305: C14.1 19.52,25.93 17.38,25.93 17.19,26.12 IC3.25
N$9
  Top 0.305: C14.2 21.98,26.11 C13.1 21.08,26.84 19.62,28.3 18.06,28.3 17.84,28.08 IC3.26
N$10
  Top 0.305: C13.2 R5.1
N$11
  Top 0.305: Y1.3 9.76,31.29 9.76,33.89 9.93,34.06 15.57,34.06 15.89,33.74 IC3.6
N$12
  Top 0.305: IC3.22 15.24,28.33 14.92,28.64 8.6,28.64 C15.1
N$13
  Top 0.305: Y1.1 7.22,32.55 7.22,33.8 8.17,34.76 16.17,34.76 16.54,34.39 IC3.5
N$14
  Top 0.305: LED1.1 4.65,21.01 R9.2
N$15
  Top 0.305: LED2.1 5.4,18.01 R10.2
NRST
  Top 0.305: C24.2 14.25,9.64 IC4.7
OSC_IN
  Top 0.305: R1.1 10.1,11.89 11.01,12.8 12.98,12.8 13.25,12.53 IC4.5
OSC_OUT
  Top 0.305: R1.3 9.38,8.18 8.93,8.18 8.77,8.34 8.77,11.17 10.85,13.25 13.49,13.25 13.75,12.99 IC4.6
OTG_FS_DM  (via drill 0.35)
  Top 0.305: J2.2 6.67,11.66 v7.63,12.62 | v13.84,20.1 13.25,20.68 IC4.44
  Bottom 0.305: v7.63,12.62 13.84,18.83 v13.84,20.1
OTG_FS_DP  (via drill 0.35)
  Top 0.305: J2.3 2.78,11.01 v2.73,11.06 | v12.31,21.39 12.31,21.74 12.75,22.18 IC4.45
  Bottom 0.305: v2.73,11.06 12.31,20.63 v12.31,21.39
RX3  (via drill 0.35)
  Top 0.305: IC4.52 10.12,19.76 10.21,19.67 10.66,19.67 10.98,19.99 10.98,20.07 v11.13,20.22
  Bottom 0.305: PAD6.1 9.06,26.15 10.98,24.23 10.98,20.37 v11.13,20.22
RX5  (via drill 0.35)
  Top 0.305: IC4.54 14.2,18.76 14.94,18.02 17.14,18.02 19.34,20.22 19.34,21.79 20.8,23.25 21.9,23.25 23.43,24.78 23.43,28.8 23.74,29.1 v23.74,31.69
  Bottom 0.305: v23.74,31.69 23,32.43 PAD4.1
SPI1_MISO_PIN
  Top 0.305: IC4.22 23.16,16.26 23.36,16.05 23.36,14.13 23.7,13.79 24.2,13.79 24.21,13.81 IC2.4
SPI1_MOSI_PIN  (via drill 0.35)
  Top 0.305: IC2.3 24,14.31 v23.97,14.34 | v21.94,16.87 21.83,16.76 IC4.23
  Bottom 0.305: v23.97,14.34 21.94,16.36 v21.94,16.87
SPI1_SCK_PIN  (via drill 0.35)
  Top 0.305: v18.09,17.04 19.37,15.76 IC4.21 | IC2.2 24.55,14.88 24.26,14.88 23.92,15.22 23.92,16.11 23.52,16.5 v23.52,16.81
  Bottom 0.305: v18.09,17.04 18.22,17.04 18.93,17.75 22.58,17.75 v23.52,16.81
SPI2_MISO_PIN  (via drill 0.35)
  Top 0.305: IC3.11 12.64,30.64 v12.96,30.32 | v18,21.55 17.75,21.79 IC4.35
  Bottom 0.305: v12.96,30.32 12.96,30 18,24.97 v18,21.55
SPI2_MOSI_PIN  (via drill 0.35)
  Top 0.305: IC3.9 13.94,30.97 v14.42,30.48 | v18.79,20.86 18.64,21.01 17.77,21.01 17.25,21.53 IC4.36
  Bottom 0.305: v18.79,20.86 19.66,21.73 19.66,24.7 14.42,29.95 v14.42,30.48
SPI2_SCK_PIN  (via drill 0.35)
  Top 0.305: IC3.10 13.29,30.78 v13.68,30.39 | v18.73,21.61 18.25,22.1 IC4.34
  Bottom 0.305: v13.68,30.39 13.68,30.04 18.81,24.91 18.81,21.69 v18.73,21.61
TX1  (via drill 0.35)
  Top 0.305: v22.04,32.5 19.96,32.5 19.48,32.02 17.06,32.02 14.73,29.68 11.63,29.68 v10.93,30.38 | IC4.42 14.25,22.4 v13.82,21.97
  Bottom 0.305: PAD11.1 22.04,32.97 v22.04,32.5 | v13.82,21.97 13.82,24.22 11.65,26.38 11.65,29.66 v10.93,30.38
TX3  (via drill 0.35)
  Top 0.305: IC4.51 10.39,20.26 v10.44,20.21
  Bottom 0.305: v10.44,20.21 9.29,21.36 9.29,25.31 7,27.59 PAD7.1
TX5  (via drill 0.35)
  Top 0.305: IC4.53 10.01,19.26 10.03,19.24 14.33,19.24 15.12,18.45 15.85,18.45 v17.86,20.46
  Bottom 0.305: v17.86,20.46 17.86,20.79 13.14,25.51 13.14,28.98 10.08,32.05 10.08,35.39 10.34,35.65 23.66,35.65 23.91,35.4 23.91,35.1 PAD5.1
VBAT_ADC_PIN
  Top 0.305: IC4.8 14.75,13.38 14.45,13.68 10.64,13.68 8.34,11.38 8.34,9.54 R8.2
  Top 0.406: R7.1 6.84,7.08 R8.2
VCC  (via drill 0.35)
  Top 0.305: 10.44,3.5 9.99,3.95 9.02,3.95 8.1,4.87 R7.2
  Top 0.508: v22.83,28.98 22.85,28.95 v22.85,26.63 | v32.3,22.42 33.29,22.42 IC1.3
  Top 1.016: X1.2 10.44,3.5 11.16,2.78 15.47,2.78 20.11,7.41 C7.2 22.95,7.41 IC5.3 25.7,10.16 29.3,10.16 30.86,8.59 C6.2 33.57,8.59 34.65,9.68 34.65,17.31 C3.2 C4.2 | C4.2 | C4.2 34.5,21.25 IC1.3
  Bottom 0.508: PAD21.1 13.98,33.03 13.98,32.58 14.42,32.14 15.5,32.14 21.02,26.63 v22.85,26.63 | v22.83,28.98 25.74,28.98 v32.3,22.42
VTX_S  (via drill 0.35)
  Top 0.305: R5.2 22.87,31.67 v22.88,31.69
  Bottom 0.305: v22.88,31.69 19.75,31.69 19,32.44 PAD2.1
(copper drawn outside any net)
  shapes: Top circle x4